# Altium schematic sheet PROBE 2 CYLINDERS.SchDoc: PROBE 2 CYLINDERS
size 558 x 401 mm; Organization: Carnegie Institution of Washington; DocumentNumber: 5; SheetNumber: 4; SheetTotal: 7; Engineer: A. BAGISH; PageSetup: Record=PageOptions|CenterHorizontal=True|CenterVertical=True|PrintScale=0.68|XCorrection=1.00|YCorrection=1.00|PrintKind=0|BorderSize=5000000|LeftOffset=0|BottomOffset=0|Orientation=2|PaperLength=1000|PaperWidth=1000|Scale=100|PaperSource=15|PrintQuality=1200|MediaType=1|DitherType=10|PaperKind=11 x 17|PrintScaleMode=1; DocumentName: PROBE 2 CYLINDERS
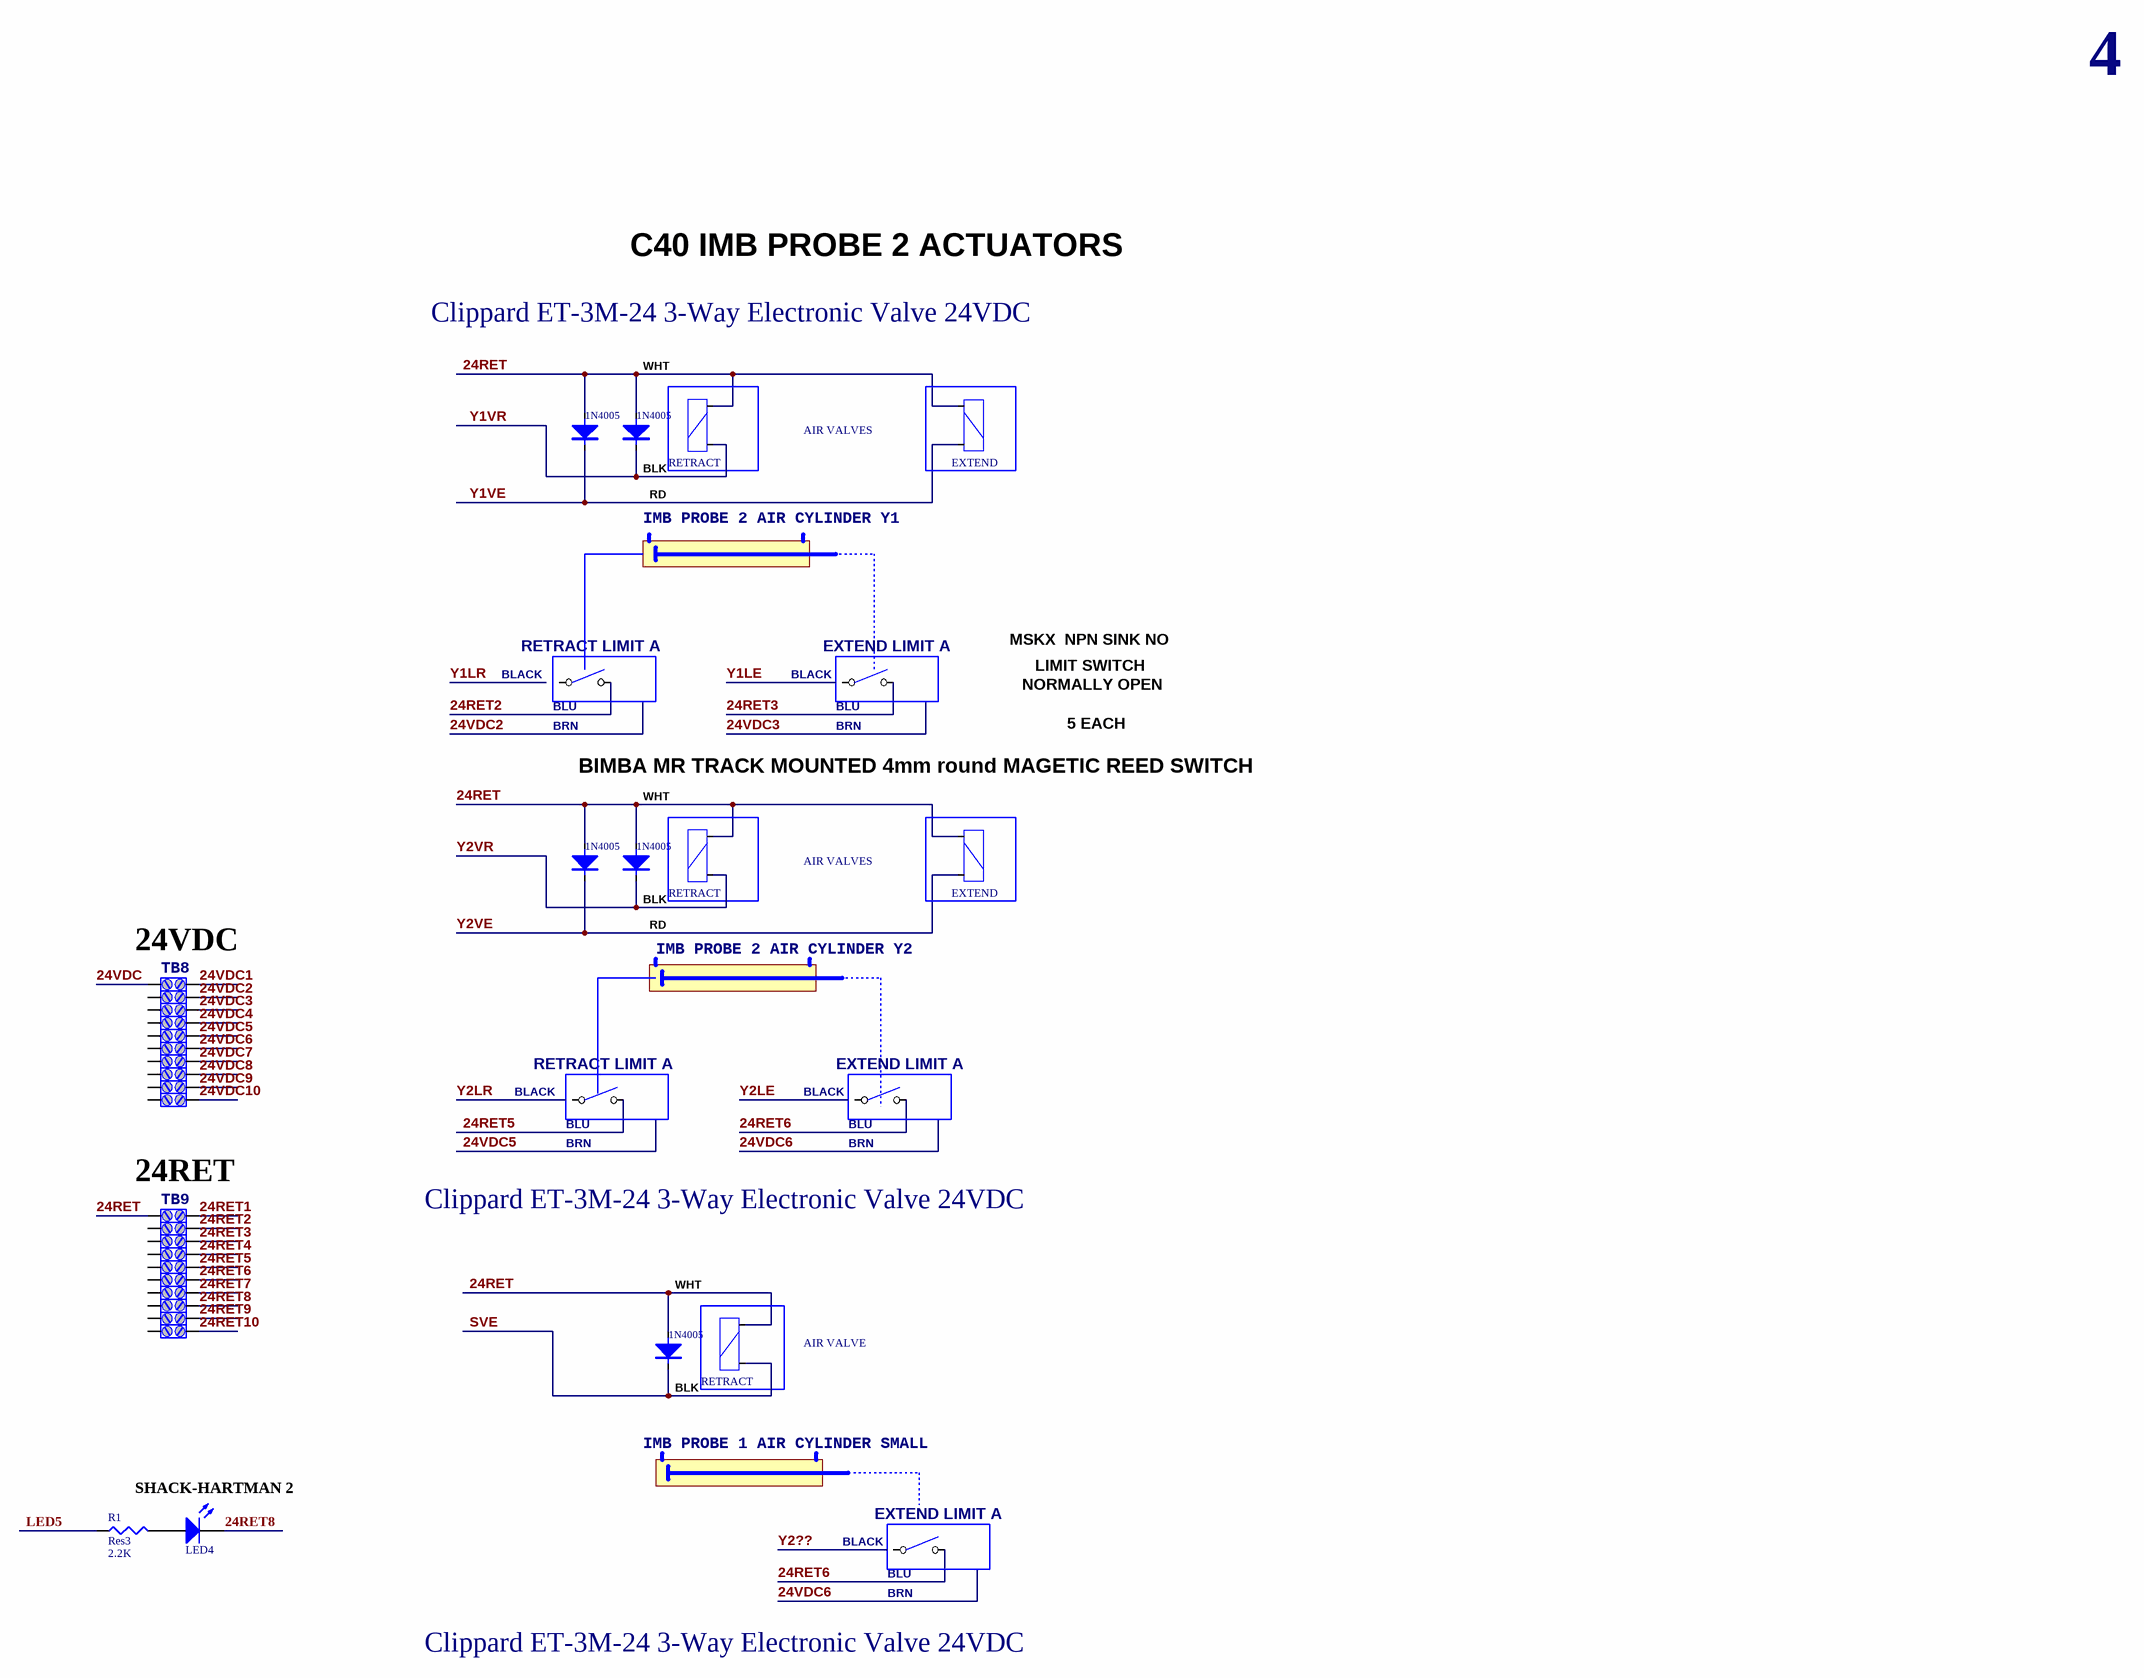
[diagram p0: PROBE 2 CYLINDERS.SchDoc]

## Parts
(Parts that share a designator on the sheet are numbered #1, #2 ... from top to bottom, then left to right.)
?#1  RETRACT
?#2  1N4005
?#3  1N4005
?#4  (no value)
?#5  (no value)
?#6  RETRACT
?#7  1N4005
?#8  1N4005
?#9  (no value)
?#10  (no value)
?#11  (no value)
?#12  (no value)
?#13  (no value)
?#14  (no value)
?#15  (no value)
?#16  (no value)
?#17  (no value)
?#18  (no value)
?#19  (no value)
?#20  (no value)
?#21  (no value)
?#22  (no value)
?#23  (no value)
?#24  (no value)
?#25  (no value)
?#26  (no value)
?#27  (no value)
?#28  (no value)
?#29  RETRACT  S: AIR VALVE
?#30  1N4005
?#31  (no value)
AIR_VALVES#1  EXTEND
AIR_VALVES#2  EXTEND
D?  LED4  [LED-0]
IMB_PROBE_1_AIR_CYLINDER_SMALL  (no value)
IMB_PROBE_2_AIR_CYLINDER_Y1  (no value)
IMB_PROBE_2_AIR_CYLINDER_Y2  (no value)
R1  Res3  value 2.2K  [J1-0603]
TB8  (no value)
TB9  (no value)

## Nets
24RET: ?#1.10(-) ?#2.1(A) ?#3.1(A) ?#6.10(-) ?#7.1(A) ?#8.1(A) ?#29.10(-) ?#30.1(A) AIR_VALVES#1.10(-) AIR_VALVES#2.10(-) TB9.2
24RET1: TB9.1
24RET2: ?#4.2 ?#20.1
24RET3: ?#5.2 ?#21.1
24RET4: ?#22.1
24RET5: ?#18.2 ?#23.1
24RET6: ?#19.2 ?#24.1 ?#31.2
24RET7: ?#25.1
24RET8: ?#26.1 D?.2(K)
24RET9: ?#27.1
24RET10: ?#28.1
24VDC: TB8.2
24VDC1: TB8.1
24VDC2: ?#9.1
24VDC3: ?#10.1
24VDC4: ?#11.1
24VDC5: ?#12.1
24VDC6: ?#13.1
24VDC7: ?#14.1
24VDC8: ?#15.1
24VDC9: ?#16.1
24VDC10: ?#17.1
LED5: R1.1
SVE: ?#29.2(+) ?#30.2(K)
Y1VE: ?#2.2(K) AIR_VALVES#1.2(+)
Y1VR: ?#1.2(+) ?#3.2(K)
Y2VE: ?#7.2(K) AIR_VALVES#2.2(+)
Y2VR: ?#6.2(+) ?#8.2(K)
NetD?_1: D?.1(A) R1.2

Not connected (* = marked no-connect by the designer): ?#4 1; ?#5 1; ?#9 2; ?#10 2; ?#11 2; ?#12 2; ?#13 2; ?#14 2; ?#15 2; ?#16 2; ?#17 2; ?#18 1; ?#19 1; ?#20 2; ?#21 2; ?#22 2; ?#23 2; ?#24 2; ?#25 2; ?#26 2; ?#27 2; ?#28 2; ?#31 1

## Notes on the sheet
- 4
- C40 IMB PROBE 2 ACTUATORS
- Clippard ET-3M-24 3-Way Electronic Valve 24VDC
- WHT
- BLK
- RD
- BLACK
- RETRACT LIMIT A
- EXTEND LIMIT A
- MSKX  NPN SINK NO
- LIMIT SWITCH
- BLU
- BRN
- NORMALLY OPEN
- 5 EACH
- BIMBA MR TRACK MOUNTED 4mm round MAGETIC REED SWITCH
- (near TB8) 24VDC
- (near TB9) 24RET
- SHACK-HARTMAN 2
- Carnegie Institution of Washington
- 813 Santa Barbara Street
- The Observatories
- PHONE (626) 577-1122               FAX (626) 795-8136
- Pasadena, California 91101
- Title:
- OCIW
- Size:
- Date:
- C
- Scale:
- Drawn By:
- Checked By:
- A. BAGISH
- alanb
- Revision:
- Sheet          of
- File:

## Library data of the parts
?#1 ?#6 ?#29 AIR_VALVES#1 AIR_VALVES#2 = COIL2
?#2 ?#3 ?#7 ?#8 ?#30 = DIODE(SHORT)
?#4 ?#5 ?#18 ?#19 ?#31 = SW-SPST
?#9 ?#20 = TB3: Part Field 1: 23; Part Field 2: 24
?#10 ?#21 = TB3: Part Field 1: 25; Part Field 2: 26
?#11 ?#22 = TB3: Part Field 1: 27; Part Field 2: 28
?#12 ?#23 = TB3: Part Field 1: 29; Part Field 2: 30
?#13 ?#24 = TB3: Part Field 1: 31; Part Field 2: 32
?#14 ?#25 = TB3: Part Field 1: 33; Part Field 2: 34
?#15 ?#26 = TB3: Part Field 1: 35; Part Field 2: 36
?#16 ?#27 = TB3: Part Field 1: 37; Part Field 2: 38
?#17 ?#28 = TB3: Part Field 1: 39; Part Field 2: 40
D? = LED0: Typical INFRARED GaAs LED; Manuf #: 607-1212-120F; Published: 8-Jun-2000; LatestRevisionDate: 08-Jul-2005; LatestRevisionNote: Mech Layer 1 removed.; PackageReference: LED-0; Publisher: Altium Limited
IMB_PROBE_1_AIR_CYLINDER_SMALL IMB_PROBE_2_AIR_CYLINDER_Y1 IMB_PROBE_2_AIR_CYLINDER_Y2 = AIR CYL LONG IN
R1 = Res3: Resistor; Published: 8-Jun-2000; LatestRevisionDate: 04-Mar-2005; LatestRevisionNote: PCB Footprint replaced.; PackageReference: J1-0603; Publisher: Altium Limited
TB8 TB9 = TB3: Part Field 1: 21; Part Field 2: 22